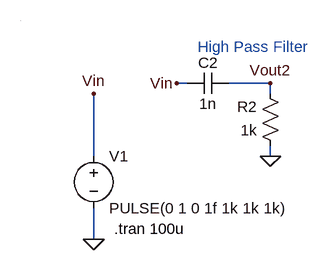
[diagram p0: schematic High Pass Filter.asc]
High Pass Filter.asc, the LTspice schematic file:
Version 4
SHEET 1 880 680
WIRE 256 96 240 96
WIRE 384 96 320 96
WIRE 384 112 384 96
WIRE 112 208 112 112
WIRE 384 208 384 192
WIRE 112 336 112 288
WIRE 0 0 0 0
FLAG 112 336 0
FLAG 112 112 Vin
FLAG 384 208 0
FLAG 384 96 Vout2
FLAG 240 96 Vin
SYMBOL res 400 208 R180
WINDOW 0 36 76 Left 2
WINDOW 3 36 40 Left 2
SYMATTR InstName R2
SYMATTR Value 1k
SYMBOL cap 320 80 R90
WINDOW 0 0 32 VBottom 2
WINDOW 3 32 32 VTop 2
SYMATTR InstName C2
SYMATTR Value 1n
SYMBOL voltage 112 192 R0
WINDOW 123 0 0 Left 2
WINDOW 39 0 0 Left 2
SYMATTR InstName V1
SYMATTR Value PULSE(0 1 0 1f 1k 1k 1k)
TEXT 144 320 Left 2 !.tran 100u
TEXT 272 40 Left 2 ;High Pass Filter

The netlist it stands for:
* High Pass Filter.asc
R2 0 Vout2 1k
C2 Vout2 Vin 1n
V1 Vin 0 PULSE(0 1 0 1f 1k 1k 1k)
.tran 100u
* High Pass Filter
.backanno
.end